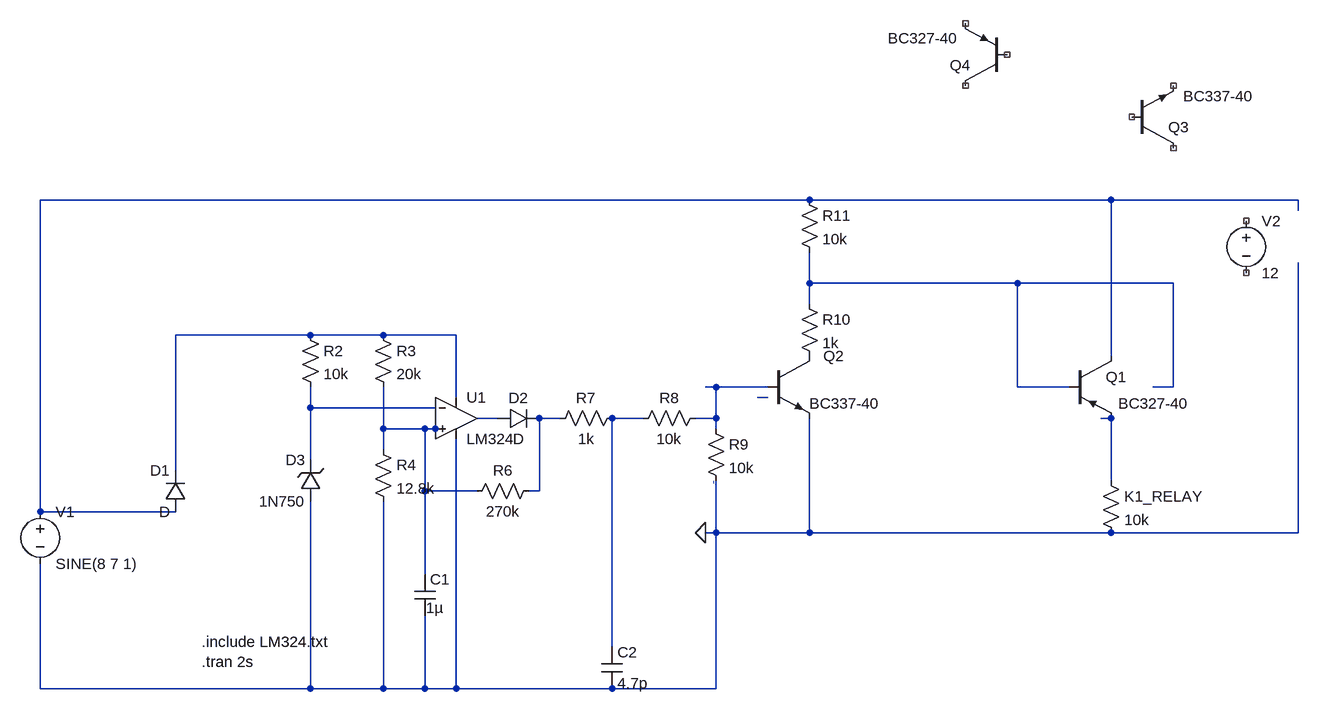
[diagram p0: schematic Komplett.asc]
Komplett.asc, the LTspice schematic file:
Version 4
SHEET 1 1020 840
WIRE 208 64 -976 64
WIRE 672 64 208 64
WIRE 960 64 672 64
WIRE 960 80 960 64
WIRE 208 192 208 144
WIRE 528 192 208 192
WIRE 768 192 528 192
WIRE 208 224 208 192
WIRE -560 272 -768 272
WIRE -448 272 -560 272
WIRE -336 272 -448 272
WIRE 672 304 672 64
WIRE 64 352 48 352
WIRE 144 352 64 352
WIRE 528 352 528 192
WIRE 608 352 528 352
WIRE 768 352 768 192
WIRE 768 352 736 352
WIRE -336 368 -336 272
WIRE 144 368 128 368
WIRE -560 384 -560 352
WIRE -368 384 -560 384
WIRE -272 400 -304 400
WIRE -176 400 -208 400
WIRE -48 400 -96 400
WIRE 64 400 64 352
WIRE 64 400 32 400
WIRE 672 400 656 400
WIRE -448 416 -448 352
WIRE -384 416 -448 416
WIRE -368 416 -384 416
WIRE -352 416 -368 416
WIRE 64 416 64 400
WIRE -448 448 -448 416
WIRE -560 464 -560 384
WIRE -768 480 -768 272
WIRE 672 496 672 400
WIRE -384 512 -384 416
WIRE -304 512 -384 512
WIRE -208 512 -208 400
WIRE -208 512 -224 512
WIRE -976 544 -976 64
WIRE -768 544 -976 544
WIRE 64 576 64 496
WIRE 64 576 48 576
WIRE 208 576 208 400
WIRE 208 576 64 576
WIRE 672 576 208 576
WIRE 960 576 960 160
WIRE 960 576 672 576
WIRE -384 640 -384 512
WIRE -96 752 -96 400
WIRE -976 816 -976 624
WIRE -560 816 -560 528
WIRE -560 816 -976 816
WIRE -448 816 -448 528
WIRE -448 816 -560 816
WIRE -384 816 -384 704
WIRE -384 816 -448 816
WIRE -336 816 -336 432
WIRE -336 816 -384 816
WIRE -96 816 -336 816
WIRE 64 816 64 576
WIRE 64 816 -96 816
FLAG 48 576 0
SYMBOL pnp 608 304 R0
WINDOW 3 75 73 Left 2
SYMATTR Value BC327-40
SYMATTR InstName Q1
SYMBOL voltage -976 528 R0
SYMATTR InstName V1
SYMATTR Value SINE(8 7 1)
SYMBOL npn 144 304 R0
WINDOW 0 85 0 Left 2
WINDOW 3 64 73 Left 2
SYMATTR InstName Q2
SYMATTR Value BC337-40
SYMBOL res 192 208 R0
SYMATTR InstName R10
SYMATTR Value 1k
SYMBOL res 48 400 R0
SYMATTR InstName R9
SYMATTR Value 10k
SYMBOL res 192 48 R0
SYMATTR InstName R11
SYMATTR Value 10k
SYMBOL voltage 880 80 R0
SYMATTR InstName V2
SYMATTR Value 12
SYMBOL npn 704 -16 M180
WINDOW 3 79 80 Left 2
SYMATTR Value BC337-40
SYMATTR InstName Q3
SYMBOL OpAmps/opamp2 -336 336 R0
SYMATTR InstName U1
SYMATTR Value LM324
SYMBOL res -576 256 R0
SYMATTR InstName R2
SYMATTR Value 10k
SYMBOL res -464 256 R0
SYMATTR InstName R3
SYMATTR Value 20k
SYMBOL res -464 432 R0
SYMATTR InstName R4
SYMATTR Value 12.8k
SYMBOL res -208 496 R90
WINDOW 0 0 56 VBottom 2
WINDOW 3 32 56 VTop 2
SYMATTR InstName R6
SYMATTR Value 270k
SYMBOL res -80 384 R90
WINDOW 0 0 56 VBottom 2
WINDOW 3 32 56 VTop 2
SYMATTR InstName R7
SYMATTR Value 1k
SYMBOL res 48 384 R90
WINDOW 0 0 56 VBottom 2
WINDOW 3 32 56 VTop 2
SYMATTR InstName R8
SYMATTR Value 10k
SYMBOL cap -400 640 R0
WINDOW 3 18 52 Left 2
SYMATTR Value 1µ
SYMATTR InstName C1
SYMBOL cap -112 752 R0
SYMATTR InstName C2
SYMATTR Value 4.7p
SYMBOL diode -752 544 R180
WINDOW 0 24 64 Left 2
WINDOW 3 24 0 Left 2
SYMATTR InstName D1
SYMBOL diode -272 416 R270
WINDOW 0 32 32 VTop 2
WINDOW 3 0 32 VBottom 2
SYMATTR InstName D2
SYMBOL zener -544 528 R180
WINDOW 0 24 64 Left 2
WINDOW 3 24 0 Left 2
SYMATTR InstName D3
SYMATTR Value 1N750
SYMATTR Type tvsdiode
SYMBOL pnp 512 -112 R180
WINDOW 3 75 73 Left 2
SYMATTR Value BC327-40
SYMATTR InstName Q4
SYMBOL res 656 480 R0
SYMATTR InstName K1_RELAY
SYMATTR Value 10k
TEXT -728 744 Left 2 !.include LM324.txt\n.tran 2s
LINE Normal 60 496 60 500 2

The netlist it stands for:
* Komplett.asc
Q1 N001 N002 N010 0 BC327-40
V1 N001 0 SINE(8 7 1)
Q2 P001 N004 0 0 BC337-40
R10 N002 P001 1k
R9 N004 0 10k
R11 N001 N002 10k
V2 NC_01 NC_02 12
Q3 NC_03 NC_04 NC_05 0 BC337-40
XU1 N011 N006 N003 0 N007 LM324  ; pins In+ In- V+ V- OUT
R2 N003 N006 10k
R3 N003 N011 20k
R4 N011 0 12.8k
R6 N008 N011 270k
R7 N009 N008 1k
R8 N004 N009 10k
C1 N011 0 1µ
C2 N009 0 4.7p
D1 N001 N003 D
D2 N007 N008 D
D3 0 N006 1N750
Q4 NC_06 NC_07 NC_08 0 BC327-40
R§K1_RELAY N010 0 10k
.model D D
.lib standard.dio
.model NPN NPN
.model PNP PNP
.lib standard.bjt
.include LM324.txt
.tran 2s
.backanno
.end